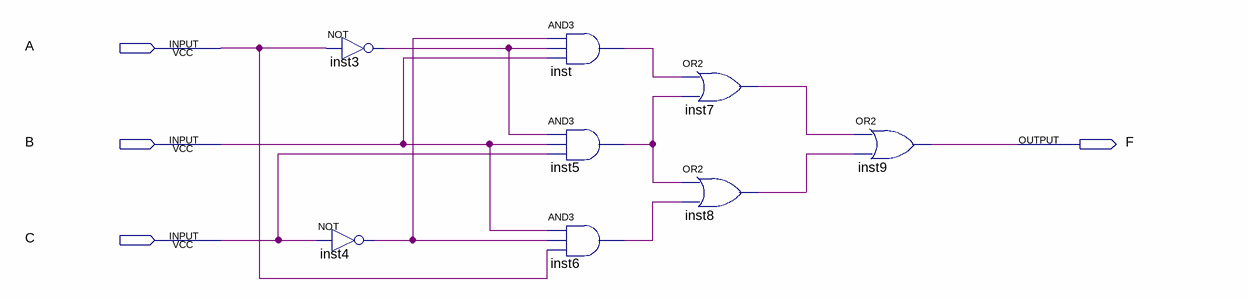
[diagram p0: schematic sheet]
// Quartus schematic lab2step1.bdf as structural Verilog: 8 symbols, 4 pins
module lab2step1 (
  input  A,
  input  B,
  input  C,
  output F
);

  wire inst3_out, inst4_out, inst5_out, inst6_out, inst7_out, inst8_out, inst_out;

  not inst4 (inst4_out, C);
  not inst3 (inst3_out, A);
  and inst (inst_out, inst4_out, inst3_out, B);
  and inst5 (inst5_out, inst3_out, B, C);
  and inst6 (inst6_out, B, inst4_out, A);
  or inst7 (inst7_out, inst_out, inst5_out);
  or inst8 (inst8_out, inst5_out, inst6_out);
  or inst9 (F, inst7_out, inst8_out);
endmodule
